# Altium schematic sheet NGUYENLY.SchDoc
size A4; SheetNumber: 1; SheetTotal: 1
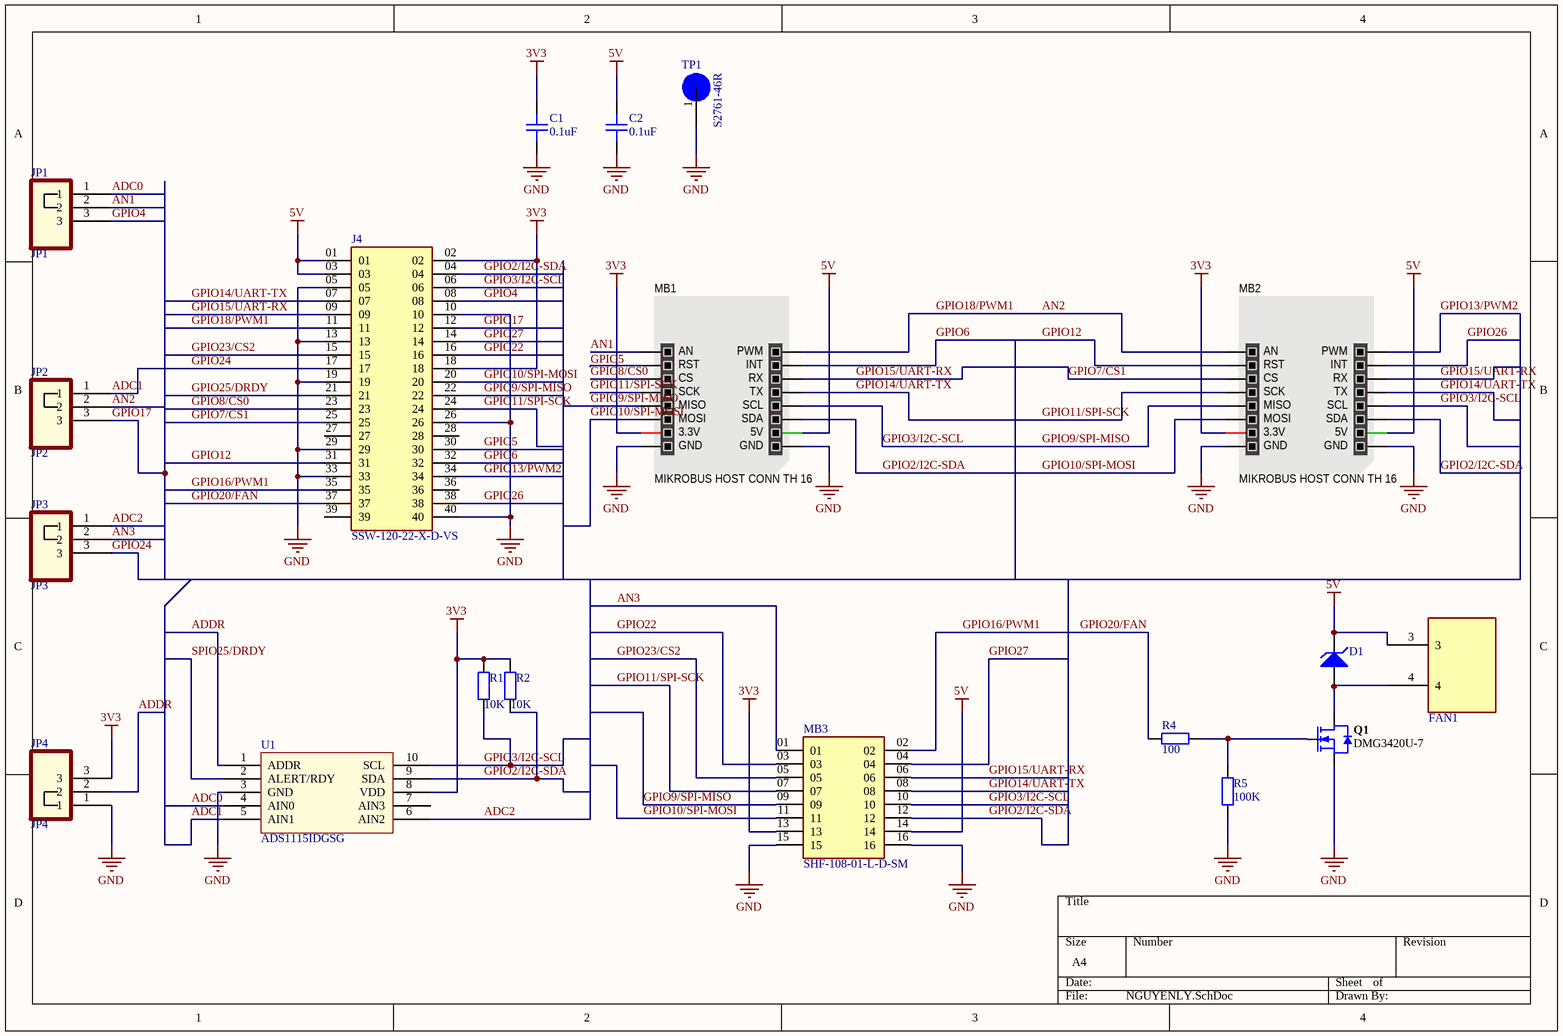
[diagram p0: NGUYENLY.SchDoc]

## Parts
C1  0.1uF  [CAPC-0603 (1608)]
C2  0.1uF  [CAPC-0603 (1608)]
D1  Diode Zener 3v3 1.5w  [DIODE_DO214AC_SMA]  (value not drawn)
FAN1  MF30101V1-1000U-A99  [Sunon_Fans_0_MFG]  (value not drawn)
J4  SSW-120-22-X-D-VS  [SAMTEC_SSW-120-22-X-D-VS]
JP1  JP1  [PCB]
JP2  JP2  [PCB]
JP3  JP3  [PCB]
JP4  JP4  [PCB]
MB1  MIKROBUS HOST CONN TH 16  [MIKROBUS HOST SMD 16 - Black]
MB2  MIKROBUS HOST CONN TH 16  [MIKROBUS HOST SMD 16 - Black]
MB3  SHF-108-01-L-D-SM  [SAMTEC_SHF-108-01-L-D-SM]
Q1  DMG3420U-7  [SOT23-123]
R1  10K  [RESC-0603 (1608)]
R2  10K  [RESC-0603 (1608)]
R4  100  [RESC-0603 (1608)]
R5  100K  [RESC-0603 (1608)]
TP1  S2761-46R  [HARWIN_S2761-46R]
U1  ADS1115IDGSG  [ADS1115IDGSR]

## Nets
3V3: C1.2 J4.02 J4.18 JP4.3 MB1.7(3.3V) MB2.7(3.3V) MB3.13 R1.2 R2.2 U1.8(VDD)
5V: C2.2 D1.2(K) FAN1.3 J4.01 J4.03 MB1.10(5V) MB2.10(5V) MB3.14
GND: C1.1 C2.1 J4.05 J4.10 J4.13 J4.19 J4.26 J4.29 J4.33 J4.40 JP4.1 MB1.8(GND) MB1.9(GND) MB2.8(GND) MB2.9(GND) MB3.15 MB3.16 Q1.3(S) R5.2 TP1.1 U1.3(GND)
ADC0: JP1.1 U1.4(AIN0)
ADC1: J4.17 JP2.1 JP3.3 U1.5(AIN1)  [also labelled GPIO24]
ADC2: JP3.1 U1.6(AIN2)
ADDR: JP4.2 U1.1(ADDR)
AN1: JP1.2 MB1.1(AN)
AN2: J4.11 J4.15 J4.21 JP2.2 MB1.16(PWM) MB2.1(AN) MB3.05  [also labelled GPIO18/PWM1, GPIO23/CS2, GPIO25/DRDY]
AN3: JP3.2 MB3.01
GPIO10/SPI-MOSI: J4.04 J4.06 J4.20 J4.22 MB1.5(MISO) MB1.6(MOSI) MB1.11(SDA) MB1.12(SCL) MB2.5(MISO) MB2.6(MOSI) MB2.11(SDA) MB2.12(SCL) MB3.09 MB3.10 MB3.11 MB3.12 R1.1 R2.1 U1.9(SDA) U1.10(SCL)  [also labelled GPIO2/I2C-SDA, GPIO3/I2C-SCL, GPIO9/SPI-MISO]
GPIO11/SPI-SCK: J4.07 J4.24 J4.30 MB1.2(RST) MB1.4(SCK) MB1.13(TX) MB2.4(SCK) MB2.13(TX) MB3.07 MB3.08  [also labelled GPIO14/UART-TX, GPIO5]
GPIO12: J4.08 J4.12 J4.31 J4.32 J4.34 J4.35 J4.37 JP1.3 JP2.3 MB1.15(INT) MB2.2(RST) MB2.16(PWM) MB3.02 R4.2  [also labelled GPIO13/PWM2, GPIO16/PWM1, GPIO17, GPIO20/FAN, GPIO4, GPIO6]
GPIO15/UART-RX: J4.09 J4.23 J4.25 MB1.3(CS) MB1.14(RX) MB2.3(CS) MB2.14(RX) MB3.06  [also labelled GPIO7/CS1, GPIO8/CS0]
GPIO22: J4.16 MB3.03
GPIO26: J4.38 MB2.15(INT)
GPIO27: J4.14 MB3.04
SPIO25/DRDY: U1.2(ALERT/RDY)
NetD1_1: D1.1(A) FAN1.4 Q1.2(D)
NetQ1_1: Q1.1(G) R4.1 R5.1

Not connected (* = marked no-connect by the designer): J4 27 28 36 39; U1 7(AIN3)

## Library data of the parts
C1 C2 = CAPC NF 0603: CAP SMD, Not Fill, 0603; Value: NF; Solder: Not Fill; Category: CAPACITOR
D1 = 1SMA5913BT3G; BZG05C3V3TR: DIODE ZENER 3.3V 1.5W SMA, DO-214AC; Solder: SMT; CompanyID: VT-00944; MPN: 1SMA5913BT3G; Value: Diode Zener 3v3 1.5w
J4 = SSW-120-22-X-D-VS: 40 Position Receptacle Connector Surface Mount; MF: Samtec; MP: SSW-120-22-G-D-VS; Package: None; Price: None; Value: *; Availability: Bad
JP1-JP4 = JP
MB1 MB2 = MIKROBUS HOST CONN
MB3 = SHF-108-01-L-D-SM: MF: Samtec; Value: *; Package: None; Price: None; MP: SHF-108-01-L-D-SM; Availability: Unavailable
Q1 = 2N7002: N-channel Enhancement Mode Field-effect Transistor; Transistor Type: NPN; Mounting Technology: Surface Mount; Status: Unreleased; Category: Transistor-FET; Parameter 1: *
R1 R2 R4 R5 = RESC NF 0603: RES SMD, Not Fill, 0603; Value: NF; Solder: Not Fill; Category: RESISTOR
TP1 = S2761-46R: Natural PC Test Point Brass, Tin Plating Surface Mount Mounting Type; MF: Harwin Inc.; MP: S2761-46R; Package: None; Purchase-URL: https://pricing.snapeda.com/search/part/S2761-46R/?ref=eda; Check_prices: https://www.snapeda.com/parts/S2761-46R/Harwin+Inc./view-part/?ref=eda; Value: *; Digi-Key_Part_Number: 952-2665-2-ND; SnapEDA_Link: https://www.snapeda.com/parts/S2761-46R/Harwin+Inc./view-part/?ref=snap